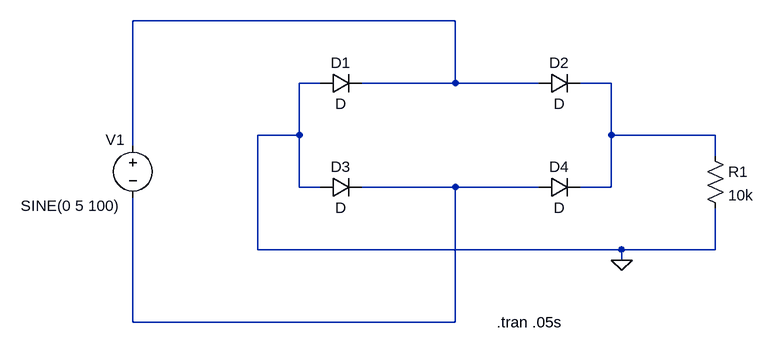
[diagram p0: schematic Lab - 03.asc]
Lab - 03.asc, the LTspice schematic file:
Version 4
SHEET 1 1456 680
WIRE 688 32 192 32
WIRE 480 128 448 128
WIRE 688 128 688 32
WIRE 688 128 544 128
WIRE 816 128 688 128
WIRE 928 128 880 128
WIRE 448 208 448 128
WIRE 448 208 384 208
WIRE 928 208 928 128
WIRE 1088 208 928 208
WIRE 192 224 192 32
WIRE 1088 240 1088 208
WIRE 448 288 448 208
WIRE 480 288 448 288
WIRE 688 288 544 288
WIRE 816 288 688 288
WIRE 928 288 928 208
WIRE 928 288 880 288
WIRE 384 384 384 208
WIRE 944 384 384 384
WIRE 1088 384 1088 320
WIRE 1088 384 944 384
WIRE 944 400 944 384
WIRE 192 496 192 304
WIRE 688 496 688 288
WIRE 688 496 192 496
FLAG 944 400 0
SYMBOL res 1072 224 R0
SYMATTR InstName R1
SYMATTR Value 10k
SYMBOL voltage 192 208 R0
WINDOW 0 -42 7 Left 2
WINDOW 3 -96 124 Bottom 2
SYMATTR InstName V1
SYMATTR Value SINE(0 5 100)
SYMBOL diode 480 144 R270
WINDOW 0 32 32 VTop 2
WINDOW 3 0 32 VBottom 2
SYMATTR InstName D1
SYMBOL diode 816 144 R270
WINDOW 0 32 32 VTop 2
WINDOW 3 0 32 VBottom 2
SYMATTR InstName D2
SYMBOL diode 480 304 R270
WINDOW 0 32 32 VTop 2
WINDOW 3 0 32 VBottom 2
SYMATTR InstName D3
SYMBOL diode 816 304 R270
WINDOW 0 32 32 VTop 2
WINDOW 3 0 32 VBottom 2
SYMATTR InstName D4
TEXT 752 496 Left 2 !.tran .05s

The netlist it stands for:
* Lab - 03.asc
R1 N002 0 10k
V1 N001 N003 SINE(0 5 100)
D1 0 N001 D
D2 N001 N002 D
D3 0 N003 D
D4 N003 N002 D
.model D D
.lib standard.dio
.tran .05s
.backanno
.end